# Altium project QCopterMV.PrjPCB
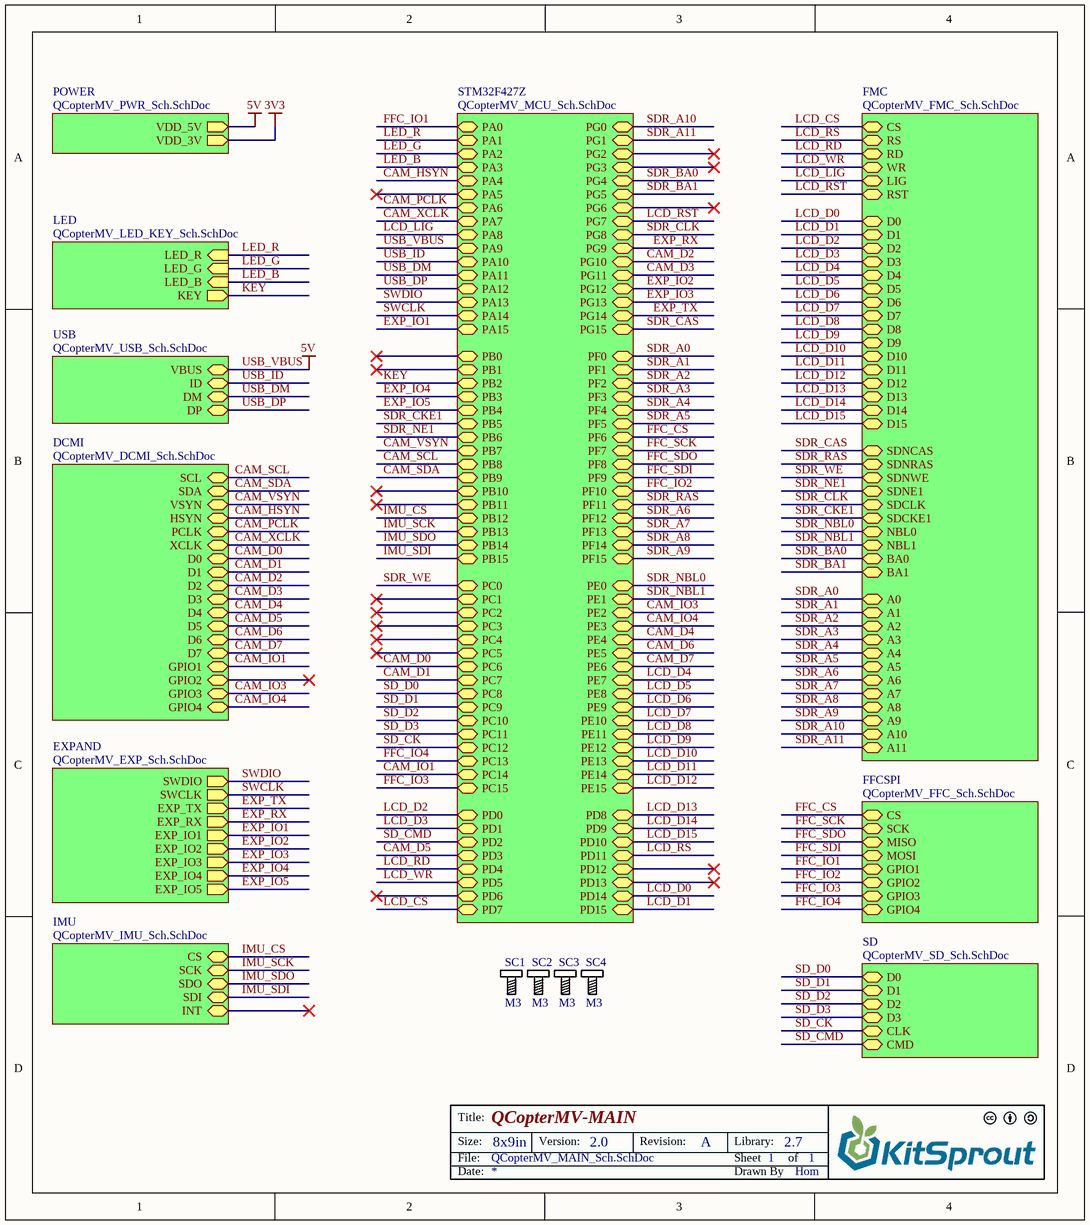
[diagram p0: QCopterMV_MAIN_Sch.SchDoc]
11 sheets, 67 parts. Net scope: hierarchical (ports join the sheet entries above them; power ports are global).
Board file: QCopterMV__Pcb.PcbDoc
Sheets:
  QCopterMV_MAIN_Sch.SchDoc
    STM32F427Z = QCopterMV_MCU_Sch.SchDoc
    FMC = QCopterMV_FMC_Sch.SchDoc
    POWER = QCopterMV_PWR_Sch.SchDoc
    LED = QCopterMV_LED_KEY_Sch.SchDoc
    FFCSPI = QCopterMV_FFC_Sch.SchDoc
    SD = QCopterMV_SD_Sch.SchDoc
    DCMI = QCopterMV_DCMI_Sch.SchDoc
    EXPAND = QCopterMV_EXP_Sch.SchDoc
    USB = QCopterMV_USB_Sch.SchDoc
    IMU = QCopterMV_IMU_Sch.SchDoc

## Sheet QCopterMV_MAIN_Sch.SchDoc: QCopterMV-MAIN
size 203 x 228 mm; Author: Hom; CompanyName: KitSprout; DrawnBy: Hom; Engineer: Hom; Organization: KitSprout; Revision: A; SheetNumber: 1; SheetTotal: 1; License: CC BY-SA 4.0; Version: 2.0; LibVersion: 2.7; PageSetup: Record=PageOptions|CenterHorizontal=True|CenterVertical=True|PrintScale=1.00|XCorrection=1.00|YCorrection=1.00|PrintKind=0|BorderSize=5000000|LeftOffset=0|BottomOffset=0|Orientation=2|PaperLength=1000|PaperWidth=1000|Scale=100|PaperSource=7|PrintQuality=-4|MediaType=1|DitherType=10|PaperKind=A4|PrintScaleMode=0

### Parts
SC1  M3  [SCRREW_M3]
SC2  M3  [SCRREW_M3]
SC3  M3  [SCRREW_M3]
SC4  M3  [SCRREW_M3]

### Sub-sheets
DCMI = QCopterMV_DCMI_Sch.SchDoc: SCL, SDA, VSYN, HSYN, PCLK, XCLK, D0, D1, D2, D3, D4, D5, D6, D7, GPIO1, GPIO2, GPIO3, GPIO4
EXPAND = QCopterMV_EXP_Sch.SchDoc: SWDIO (out), SWCLK (out), EXP_TX (out), EXP_RX (out), EXP_IO1 (out), EXP_IO2 (out), EXP_IO3 (out), EXP_IO4 (out), EXP_IO5 (out)
FFCSPI = QCopterMV_FFC_Sch.SchDoc: MISO, CS, MOSI, SCK, GPIO1, GPIO2, GPIO3, GPIO4
FMC = QCopterMV_FMC_Sch.SchDoc: D0, D1, D2, D3, D4, D5, D6, D7, D8, D9, D10, D11, D12, D13, D14, D15, RD, WR, CS, RS, LIG, RST, NBL0, NBL1, BA1, BA0, SDNRAS, SDNCAS, SDNWE, SDNE1, SDCLK, SDCKE1, A0, A1, A2, A3, A4, A5, A6, A7, A8, A9, A10, A11
IMU = QCopterMV_IMU_Sch.SchDoc: SDO, SCK, SDI, CS, INT
LED = QCopterMV_LED_KEY_Sch.SchDoc: LED_R (in), LED_G (in), LED_B (in), KEY (out)
POWER = QCopterMV_PWR_Sch.SchDoc: VDD_3V (out), VDD_5V (out)
SD = QCopterMV_SD_Sch.SchDoc: D0, CMD, D1, D2, D3, CLK
STM32F427Z = QCopterMV_MCU_Sch.SchDoc: PA0, PA1, PA2, PA3, PA4, PA5, PA6, PA7, PA8, PA9, PA10, PA11, PA12, PA13, PA14, PA15, PB0, PB1, PB2, PB3, PB4, PB5, PB6, PB7, PB8, PB9, PB10, PB12, PB13, PB14, PB15, PC0, PC1, PC2, PC3, PC5, PC6, PC7, PC8, PC9, PC10, PC11, PC12, PC13, PC14, PB11, PD0, PC4, PC15, PD1, PD2, PD3, PD4, PD5, PD6, PD7, PD8, PD9, PD10, PD11, PD12, PD13, PD14, PD15, PE0, PF0, PG0, PG1, PG2, PG3, PG4, PG5, PG6, PG7, PG8, PG9, PG10, PG11, PG12, PG13, PG14, PG15, PF1, PF2, PF3, PF4, PF5, PF6, PF7, PF8, PF9, PF10, PF11, PF12, PF13, PF14, PF15, PE1, PE2, PE3, PE4, PE5, PE6, PE7, PE8, PE9, PE10, PE11, PE12, PE13, PE14, PE15
USB = QCopterMV_USB_Sch.SchDoc: VBUS, ID, DM, DP

### Nets
USB_VBUS: sheet STM32F427Z/PA9, sheet POWER/VDD_5V, sheet USB/VBUS  [also labelled 5V]
CAM_D0: sheet STM32F427Z/PC6, sheet DCMI/D0
CAM_D1: sheet STM32F427Z/PC7, sheet DCMI/D1
CAM_D2: sheet STM32F427Z/PG10, sheet DCMI/D2
CAM_D3: sheet STM32F427Z/PG11, sheet DCMI/D3
CAM_D4: sheet STM32F427Z/PE4, sheet DCMI/D4
CAM_D5: sheet STM32F427Z/PD3, sheet DCMI/D5
CAM_D6: sheet STM32F427Z/PE5, sheet DCMI/D6
CAM_D7: sheet STM32F427Z/PE6, sheet DCMI/D7
CAM_HSYN: sheet STM32F427Z/PA4, sheet DCMI/HSYN
CAM_IO1: sheet STM32F427Z/PC14, sheet DCMI/GPIO1
CAM_IO3: sheet STM32F427Z/PE2, sheet DCMI/GPIO3
CAM_IO4: sheet STM32F427Z/PE3, sheet DCMI/GPIO4
CAM_PCLK: sheet STM32F427Z/PA6, sheet DCMI/PCLK
CAM_SCL: sheet STM32F427Z/PB8, sheet DCMI/SCL
CAM_SDA: sheet STM32F427Z/PB9, sheet DCMI/SDA
CAM_VSYN: sheet STM32F427Z/PB7, sheet DCMI/VSYN
CAM_XCLK: sheet STM32F427Z/PA7, sheet DCMI/XCLK
EXP_IO1: sheet STM32F427Z/PA15, sheet EXPAND/EXP_IO1
EXP_IO2: sheet STM32F427Z/PG12, sheet EXPAND/EXP_IO2
EXP_IO3: sheet STM32F427Z/PG13, sheet EXPAND/EXP_IO3
EXP_IO4: sheet STM32F427Z/PB3, sheet EXPAND/EXP_IO4
EXP_IO5: sheet STM32F427Z/PB4, sheet EXPAND/EXP_IO5
EXP_RX: sheet STM32F427Z/PG9, sheet EXPAND/EXP_RX
EXP_TX: sheet STM32F427Z/PG14, sheet EXPAND/EXP_TX
FFC_CS: sheet STM32F427Z/PF6, sheet FFCSPI/CS
FFC_IO1: sheet STM32F427Z/PA0, sheet FFCSPI/GPIO1
FFC_IO2: sheet STM32F427Z/PF10, sheet FFCSPI/GPIO2
FFC_IO3: sheet STM32F427Z/PC15, sheet FFCSPI/GPIO3
FFC_IO4: sheet STM32F427Z/PC13, sheet FFCSPI/GPIO4
FFC_SCK: sheet STM32F427Z/PF7, sheet FFCSPI/SCK
FFC_SDI: sheet STM32F427Z/PF9, sheet FFCSPI/MOSI
FFC_SDO: sheet STM32F427Z/PF8, sheet FFCSPI/MISO
IMU_CS: sheet STM32F427Z/PB12, sheet IMU/CS
IMU_SCK: sheet STM32F427Z/PB13, sheet IMU/SCK
IMU_SDI: sheet STM32F427Z/PB15, sheet IMU/SDI
IMU_SDO: sheet STM32F427Z/PB14, sheet IMU/SDO
KEY: sheet STM32F427Z/PB2, sheet LED/KEY
LCD_CS: sheet STM32F427Z/PD7, sheet FMC/CS
LCD_D0: sheet STM32F427Z/PD14, sheet FMC/D0
LCD_D1: sheet STM32F427Z/PD15, sheet FMC/D1
LCD_D2: sheet STM32F427Z/PD0, sheet FMC/D2
LCD_D3: sheet STM32F427Z/PD1, sheet FMC/D3
LCD_D4: sheet STM32F427Z/PE7, sheet FMC/D4
LCD_D5: sheet STM32F427Z/PE8, sheet FMC/D5
LCD_D6: sheet STM32F427Z/PE9, sheet FMC/D6
LCD_D7: sheet STM32F427Z/PE10, sheet FMC/D7
LCD_D8: sheet STM32F427Z/PE11, sheet FMC/D8
LCD_D9: sheet STM32F427Z/PE12, sheet FMC/D9
LCD_D10: sheet STM32F427Z/PE13, sheet FMC/D10
LCD_D11: sheet STM32F427Z/PE14, sheet FMC/D11
LCD_D12: sheet STM32F427Z/PE15, sheet FMC/D12
LCD_D13: sheet STM32F427Z/PD8, sheet FMC/D13
LCD_D14: sheet STM32F427Z/PD9, sheet FMC/D14
LCD_D15: sheet STM32F427Z/PD10, sheet FMC/D15
LCD_LIG: sheet STM32F427Z/PA8, sheet FMC/LIG
LCD_RD: sheet STM32F427Z/PD4, sheet FMC/RD
LCD_RS: sheet STM32F427Z/PD11, sheet FMC/RS
LCD_RST: sheet STM32F427Z/PG7, sheet FMC/RST
LCD_WR: sheet STM32F427Z/PD5, sheet FMC/WR
LED_B: sheet STM32F427Z/PA3, sheet LED/LED_B
LED_G: sheet STM32F427Z/PA2, sheet LED/LED_G
LED_R: sheet STM32F427Z/PA1, sheet LED/LED_R
SD_CK: sheet STM32F427Z/PC12, sheet SD/CLK
SD_CMD: sheet STM32F427Z/PD2, sheet SD/CMD
SD_D0: sheet STM32F427Z/PC8, sheet SD/D0
SD_D1: sheet STM32F427Z/PC9, sheet SD/D1
SD_D2: sheet STM32F427Z/PC10, sheet SD/D2
SD_D3: sheet STM32F427Z/PC11, sheet SD/D3
SDR_A0: sheet STM32F427Z/PF0, sheet FMC/A0
SDR_A1: sheet STM32F427Z/PF1, sheet FMC/A1
SDR_A2: sheet STM32F427Z/PF2, sheet FMC/A2
SDR_A3: sheet STM32F427Z/PF3, sheet FMC/A3
SDR_A4: sheet STM32F427Z/PF4, sheet FMC/A4
SDR_A5: sheet STM32F427Z/PF5, sheet FMC/A5
SDR_A6: sheet STM32F427Z/PF12, sheet FMC/A6
SDR_A7: sheet STM32F427Z/PF13, sheet FMC/A7
SDR_A8: sheet STM32F427Z/PF14, sheet FMC/A8
SDR_A9: sheet STM32F427Z/PF15, sheet FMC/A9
SDR_A10: sheet STM32F427Z/PG0, sheet FMC/A10
SDR_A11: sheet STM32F427Z/PG1, sheet FMC/A11
SDR_BA0: sheet STM32F427Z/PG4, sheet FMC/BA0
SDR_BA1: sheet STM32F427Z/PG5, sheet FMC/BA1
SDR_CAS: sheet STM32F427Z/PG15, sheet FMC/SDNCAS
SDR_CKE1: sheet STM32F427Z/PB5, sheet FMC/SDCKE1
SDR_CLK: sheet STM32F427Z/PG8, sheet FMC/SDCLK
SDR_NBL0: sheet STM32F427Z/PE0, sheet FMC/NBL0
SDR_NBL1: sheet STM32F427Z/PE1, sheet FMC/NBL1
SDR_NE1: sheet STM32F427Z/PB6, sheet FMC/SDNE1
SDR_RAS: sheet STM32F427Z/PF11, sheet FMC/SDNRAS
SDR_WE: sheet STM32F427Z/PC0, sheet FMC/SDNWE
SWCLK: sheet STM32F427Z/PA14, sheet EXPAND/SWCLK
SWDIO: sheet STM32F427Z/PA13, sheet EXPAND/SWDIO
USB_DM: sheet STM32F427Z/PA11, sheet USB/DM
USB_DP: sheet STM32F427Z/PA12, sheet USB/DP
USB_ID: sheet STM32F427Z/PA10, sheet USB/ID

### Notes on the sheet
- Title:
- Size:
- Date:
- File:
- 8x9in
- Version:
- Revision:
- Sheet
- Drawn By
- Library:
- of

### Library data of the parts
SC1-SC4 = Screw_M3: Screw

## Sheet QCopterMV_MCU_Sch.SchDoc: QCopterMV-MCU
size 177 x 203 mm; Author: Hom; CompanyName: KitSprout; DrawnBy: Hom; Engineer: Hom; Organization: KitSprout; Revision: A; SheetNumber: 1; SheetTotal: 1; License: CC BY-SA 4.0; Version: 2.0; LibVersion: 2.7; PageSetup: Record=PageOptions|CenterHorizontal=True|CenterVertical=True|PrintScale=1.00|XCorrection=1.00|YCorrection=1.00|PrintKind=0|BorderSize=5000000|LeftOffset=0|BottomOffset=0|Orientation=2|PaperLength=1000|PaperWidth=1000|Scale=100|PaperSource=7|PrintQuality=-4|MediaType=1|DitherType=10|PaperKind=A4|PrintScaleMode=0
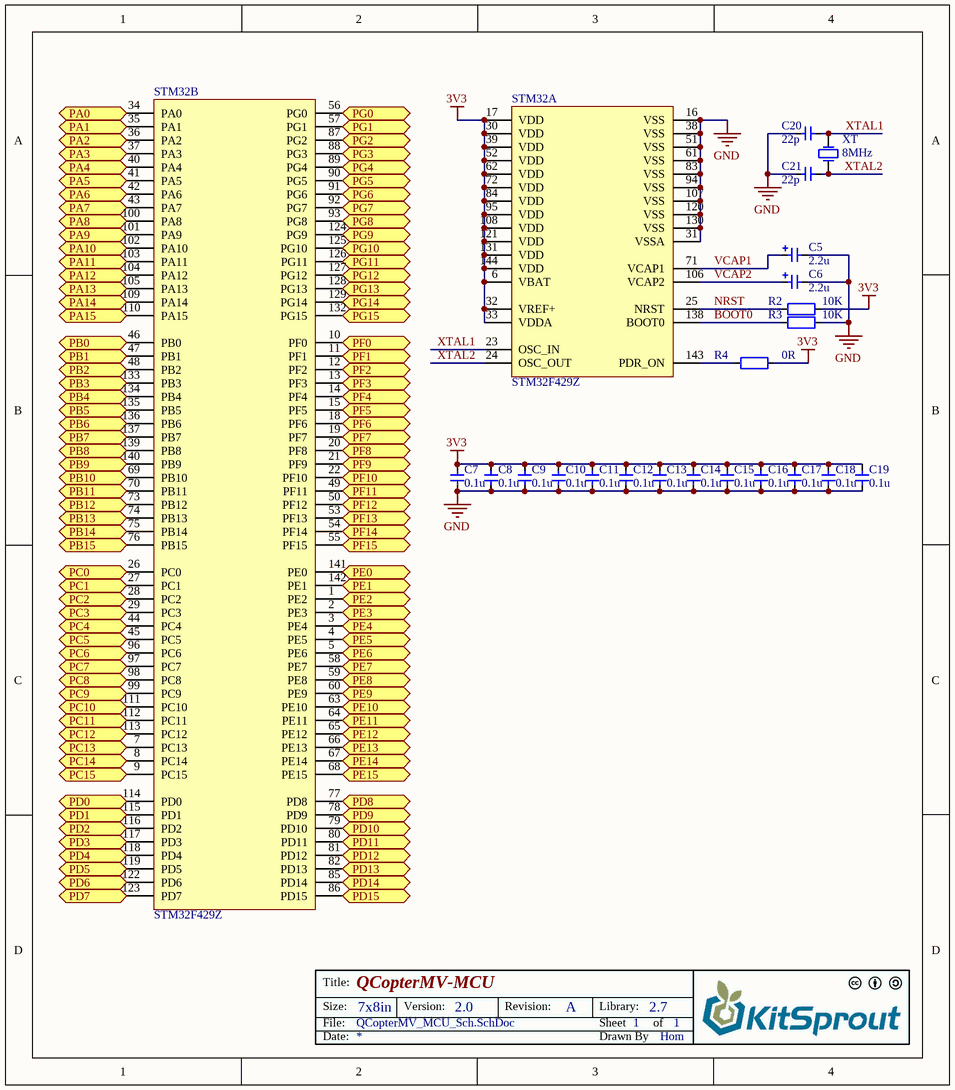
[diagram p1: QCopterMV_MCU_Sch.SchDoc]

### Parts
C5  value 2.2u  [CAP_TAN_P0805]  (hidden comment: Cap_Tan_0805)
C6  value 2.2u  [CAP_TAN_P0805]  (hidden comment: Cap_Tan_0805)
C7  value 0.1u  [CAP_0402]  (hidden comment: Cap_0402)
C8  value 0.1u  [CAP_0402]  (hidden comment: Cap_0402)
C9  value 0.1u  [CAP_0402]  (hidden comment: Cap_0402)
C10  value 0.1u  [CAP_0402]  (hidden comment: Cap_0402)
C11  value 0.1u  [CAP_0402]  (hidden comment: Cap_0402)
C12  value 0.1u  [CAP_0402]  (hidden comment: Cap_0402)
C13  value 0.1u  [CAP_0402]  (hidden comment: Cap_0402)
C14  value 0.1u  [CAP_0402]  (hidden comment: Cap_0402)
C15  value 0.1u  [CAP_0402]  (hidden comment: Cap_0402)
C16  value 0.1u  [CAP_0402]  (hidden comment: Cap_0402)
C17  value 0.1u  [CAP_0402]  (hidden comment: Cap_0402)
C18  value 0.1u  [CAP_0402]  (hidden comment: Cap_0402)
C19  value 0.1u  [CAP_0402]  (hidden comment: Cap_0402)
C20  value 22p  [CAP_0402]  (hidden comment: Cap_0402)
C21  value 22p  [CAP_0402]  (hidden comment: Cap_0402)
R2  value 10K  [RES_0402]  (hidden comment: Res_0402)
R3  value 10K  [RES_0402]  (hidden comment: Res_0402)
R4  value 0R  [RES_0402]  (hidden comment: Res_0402)
STM32  STM32F429Z  [LQFP_P0.5_144]  (parts A,B of 2)
XT  value 8MHz  [XT_3225_2]  (hidden comment: XTAL_3225_2P)

### Ports
PA0, PA1, PA2, PA3, PA4, PA5, PA6, PA7, PA8, PA9, PA10, PA11, PA12, PA13, PA14, PA15, PB0, PB1, PB2, PB3, PB4, PB5, PB6, PB7, PB8, PB9, PB10, PB11, PB12, PB13, PB14, PB15, PC0, PC1, PC2, PC3, PC4, PC5, PC6, PC7, PC8, PC9, PC10, PC11, PC12, PC13, PC14, PC15, PD0, PD1, PD2, PD3, PD4, PD5, PD6, PD7, PD8, PD9, PD10, PD11, PD12, PD13, PD14, PD15, PE0, PE1, PE2, PE3, PE4, PE5, PE6, PE7, PE8, PE9, PE10, PE11, PE12, PE13, PE14, PE15, PF0, PF1, PF2, PF3, PF4, PF5, PF6, PF7, PF8, PF9, PF10, PF11, PF12, PF13, PF14, PF15, PG0, PG1, PG2, PG3, PG4, PG5, PG6, PG7, PG8, PG9, PG10, PG11, PG12, PG13, PG14, PG15

### Nets
3V3: C7.2 C8.2 C9.2 C10.2 C11.2 C12.2 C13.2 C14.2 C15.2 C16.2 C17.2 C18.2 C19.2 R2.1 R4.1 STM32.6(VBAT) STM32.17(VDD) STM32.30(VDD) STM32.32(VREF+) STM32.33(VDDA) STM32.39(VDD) STM32.52(VDD) STM32.62(VDD) STM32.72(VDD) STM32.84(VDD) STM32.95(VDD) STM32.108(VDD) STM32.121(VDD) STM32.131(VDD) STM32.144(VDD)
GND: C5.2 C6.2 C7.1 C8.1 C9.1 C10.1 C11.1 C12.1 C13.1 C14.1 C15.1 C16.1 C17.1 C18.1 C19.1 C20.1 C21.1 R3.1 STM32.16(VSS) STM32.31(VSSA) STM32.38(VSS) STM32.51(VSS) STM32.61(VSS) STM32.83(VSS) STM32.94(VSS) STM32.107(VSS) STM32.120(VSS) STM32.130(VSS)
USB_VBUS: STM32.101(PA9) ; port PA9
BOOT0: R3.2 STM32.138(BOOT0)
CAM_D0: STM32.96(PC6) ; port PC6
CAM_D1: STM32.97(PC7) ; port PC7
CAM_D2: STM32.125(PG10) ; port PG10
CAM_D3: STM32.126(PG11) ; port PG11
CAM_D4: STM32.3(PE4) ; port PE4
CAM_D5: STM32.117(PD3) ; port PD3
CAM_D6: STM32.4(PE5) ; port PE5
CAM_D7: STM32.5(PE6) ; port PE6
CAM_HSYN: STM32.40(PA4) ; port PA4
CAM_IO1: STM32.8(PC14) ; port PC14
CAM_IO3: STM32.1(PE2) ; port PE2
CAM_IO4: STM32.2(PE3) ; port PE3
CAM_PCLK: STM32.42(PA6) ; port PA6
CAM_SCL: STM32.139(PB8) ; port PB8
CAM_SDA: STM32.140(PB9) ; port PB9
CAM_VSYN: STM32.137(PB7) ; port PB7
CAM_XCLK: STM32.43(PA7) ; port PA7
EXP_IO1: STM32.110(PA15) ; port PA15
EXP_IO2: STM32.127(PG12) ; port PG12
EXP_IO3: STM32.128(PG13) ; port PG13
EXP_IO4: STM32.133(PB3) ; port PB3
EXP_IO5: STM32.134(PB4) ; port PB4
EXP_RX: STM32.124(PG9) ; port PG9
EXP_TX: STM32.129(PG14) ; port PG14
FFC_CS: STM32.18(PF6) ; port PF6
FFC_IO1: STM32.34(PA0) ; port PA0
FFC_IO2: STM32.22(PF10) ; port PF10
FFC_IO3: STM32.9(PC15) ; port PC15
FFC_IO4: STM32.7(PC13) ; port PC13
FFC_SCK: STM32.19(PF7) ; port PF7
FFC_SDI: STM32.21(PF9) ; port PF9
FFC_SDO: STM32.20(PF8) ; port PF8
IMU_CS: STM32.73(PB12) ; port PB12
IMU_SCK: STM32.74(PB13) ; port PB13
IMU_SDI: STM32.76(PB15) ; port PB15
IMU_SDO: STM32.75(PB14) ; port PB14
KEY: STM32.48(PB2) ; port PB2
LCD_CS: STM32.123(PD7) ; port PD7
LCD_D0: STM32.85(PD14) ; port PD14
LCD_D1: STM32.86(PD15) ; port PD15
LCD_D2: STM32.114(PD0) ; port PD0
LCD_D3: STM32.115(PD1) ; port PD1
LCD_D4: STM32.58(PE7) ; port PE7
LCD_D5: STM32.59(PE8) ; port PE8
LCD_D6: STM32.60(PE9) ; port PE9
LCD_D7: STM32.63(PE10) ; port PE10
LCD_D8: STM32.64(PE11) ; port PE11
LCD_D9: STM32.65(PE12) ; port PE12
LCD_D10: STM32.66(PE13) ; port PE13
LCD_D11: STM32.67(PE14) ; port PE14
LCD_D12: STM32.68(PE15) ; port PE15
LCD_D13: STM32.77(PD8) ; port PD8
LCD_D14: STM32.78(PD9) ; port PD9
LCD_D15: STM32.79(PD10) ; port PD10
LCD_LIG: STM32.100(PA8) ; port PA8
LCD_RD: STM32.118(PD4) ; port PD4
LCD_RS: STM32.80(PD11) ; port PD11
LCD_RST: STM32.92(PG7) ; port PG7
LCD_WR: STM32.119(PD5) ; port PD5
LED_B: STM32.37(PA3) ; port PA3
LED_G: STM32.36(PA2) ; port PA2
LED_R: STM32.35(PA1) ; port PA1
NRST: R2.2 STM32.25(NRST)
SD_CK: STM32.113(PC12) ; port PC12
SD_CMD: STM32.116(PD2) ; port PD2
SD_D0: STM32.98(PC8) ; port PC8
SD_D1: STM32.99(PC9) ; port PC9
SD_D2: STM32.111(PC10) ; port PC10
SD_D3: STM32.112(PC11) ; port PC11
SDR_A0: STM32.10(PF0) ; port PF0
SDR_A1: STM32.11(PF1) ; port PF1
SDR_A2: STM32.12(PF2) ; port PF2
SDR_A3: STM32.13(PF3) ; port PF3
SDR_A4: STM32.14(PF4) ; port PF4
SDR_A5: STM32.15(PF5) ; port PF5
SDR_A6: STM32.50(PF12) ; port PF12
SDR_A7: STM32.53(PF13) ; port PF13
SDR_A8: STM32.54(PF14) ; port PF14
SDR_A9: STM32.55(PF15) ; port PF15
SDR_A10: STM32.56(PG0) ; port PG0
SDR_A11: STM32.57(PG1) ; port PG1
SDR_BA0: STM32.89(PG4) ; port PG4
SDR_BA1: STM32.90(PG5) ; port PG5
SDR_CAS: STM32.132(PG15) ; port PG15
SDR_CKE1: STM32.135(PB5) ; port PB5
SDR_CLK: STM32.93(PG8) ; port PG8
SDR_NBL0: STM32.141(PE0) ; port PE0
SDR_NBL1: STM32.142(PE1) ; port PE1
SDR_NE1: STM32.136(PB6) ; port PB6
SDR_RAS: STM32.49(PF11) ; port PF11
SDR_WE: STM32.26(PC0) ; port PC0
SWCLK: STM32.109(PA14) ; port PA14
SWDIO: STM32.105(PA13) ; port PA13
USB_DM: STM32.103(PA11) ; port PA11
USB_DP: STM32.104(PA12) ; port PA12
USB_ID: STM32.102(PA10) ; port PA10
VCAP1: C5.1 STM32.71(VCAP1)
VCAP2: C6.1 STM32.106(VCAP2)
XTAL1: C20.2 STM32.23(OSC_IN) XT.2(OSC2)
XTAL2: C21.2 STM32.24(OSC_OUT) XT.1(OSC1)
NetR4_2: R4.2 STM32.143(PDR_ON)
NetSTM32_27: STM32.27(PC1) ; port PC1
NetSTM32_28: STM32.28(PC2) ; port PC2
NetSTM32_29: STM32.29(PC3) ; port PC3
NetSTM32_41: STM32.41(PA5) ; port PA5
NetSTM32_44: STM32.44(PC4) ; port PC4
NetSTM32_45: STM32.45(PC5) ; port PC5
NetSTM32_46: STM32.46(PB0) ; port PB0
NetSTM32_47: STM32.47(PB1) ; port PB1
NetSTM32_69: STM32.69(PB10) ; port PB10
NetSTM32_70: STM32.70(PB11) ; port PB11
NetSTM32_81: STM32.81(PD12) ; port PD12
NetSTM32_82: STM32.82(PD13) ; port PD13
NetSTM32_87: STM32.87(PG2) ; port PG2
NetSTM32_88: STM32.88(PG3) ; port PG3
NetSTM32_91: STM32.91(PG6) ; port PG6
NetSTM32_122: STM32.122(PD6) ; port PD6

### Notes on the sheet
- Title:
- Size:
- Date:
- File:
- 7x8in
- Version:
- Revision:
- Sheet
- Drawn By
- Library:
- of

### Library data of the parts
C5 C6 = Cap_Tan_0805: Capacitor
C7-C21 = Cap_0402: Capacitor
R2-R4 = Res_0402: Resistor
STM32 = STM32F439Z: MCU
XT = XTAL_3225_2P: Crystal Oscillator

## Sheet QCopterMV_FMC_Sch.SchDoc: QCopterMV-FMC
size 152 x 127 mm; Author: Hom; CompanyName: KitSprout; DrawnBy: Hom; Engineer: Hom; Organization: KitSprout; Revision: A; SheetNumber: 1; SheetTotal: 1; License: CC BY-SA 4.0; Version: 2.0; LibVersion: 2.7; PageSetup: Record=PageOptions|CenterHorizontal=True|CenterVertical=True|PrintScale=1.00|XCorrection=1.00|YCorrection=1.00|PrintKind=0|BorderSize=5000000|LeftOffset=0|BottomOffset=0|Orientation=2|PaperLength=1000|PaperWidth=1000|Scale=100|PaperSource=7|PrintQuality=-4|MediaType=1|DitherType=10|PaperKind=A4|PrintScaleMode=0
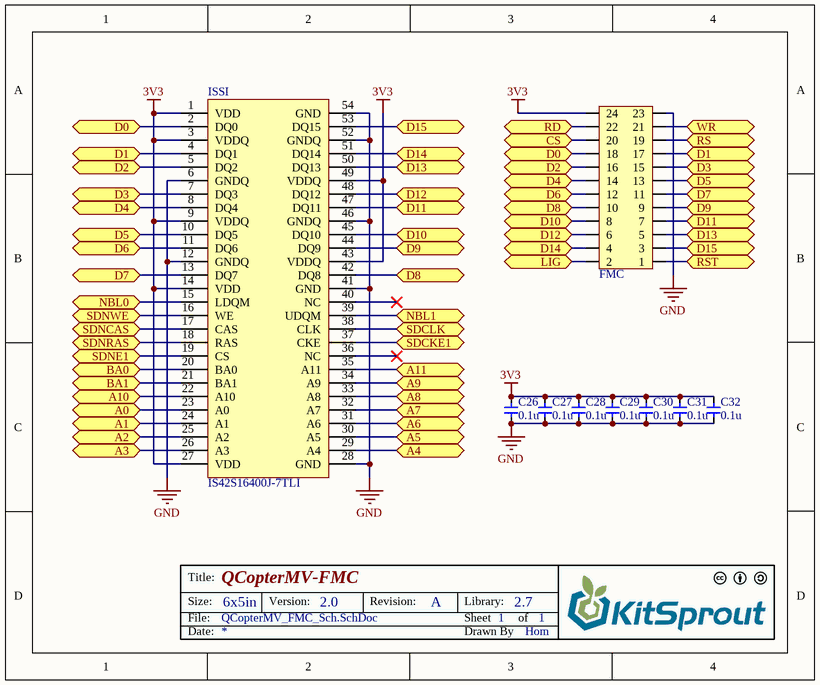
[diagram p2: QCopterMV_FMC_Sch.SchDoc]

### Parts
C26  value 0.1u  [CAP_0402]  (hidden comment: Cap_0402)
C27  value 0.1u  [CAP_0402]  (hidden comment: Cap_0402)
C28  value 0.1u  [CAP_0402]  (hidden comment: Cap_0402)
C29  value 0.1u  [CAP_0402]  (hidden comment: Cap_0402)
C30  value 0.1u  [CAP_0402]  (hidden comment: Cap_0402)
C31  value 0.1u  [CAP_0402]  (hidden comment: Cap_0402)
C32  value 0.1u  [CAP_0402]  (hidden comment: Cap_0402)
FMC  HDR2x12_1.27  [HDR2X12_1.27_180HF]  (value not drawn)
ISSI  IS42S16400J-7TLI  [TSOP_E400_P0.8_54]

### Ports
A0, A1, A2, A3, A4, A5, A6, A7, A8, A9, A10, A11, BA0, BA1, CS, D0, D1, D2, D3, D4, D5, D6, D7, D8, D9, D10, D11, D12, D13, D14, D15, LIG, NBL0, NBL1, RD, RS, RST, SDCKE1, SDCLK, SDNCAS, SDNE1, SDNRAS, SDNWE, WR

### Nets
3V3: C26.2 C27.2 C28.2 C29.2 C30.2 C31.2 C32.2 FMC.24 ISSI.1(VDD) ISSI.3(VDDQ) ISSI.9(VDDQ) ISSI.14(VDD) ISSI.27(VDD) ISSI.43(VDDQ) ISSI.49(VDDQ)
GND: C26.1 C27.1 C28.1 C29.1 C30.1 C31.1 C32.1 FMC.23 ISSI.6(GNDQ) ISSI.12(GNDQ) ISSI.28(GND) ISSI.41(GND) ISSI.46(GNDQ) ISSI.52(GNDQ) ISSI.54(GND)
LCD_CS: FMC.20 ; port CS
LCD_D0: FMC.18 ISSI.2(DQ0) ; port D0
LCD_D1: FMC.17 ISSI.4(DQ1) ; port D1
LCD_D2: FMC.16 ISSI.5(DQ2) ; port D2
LCD_D3: FMC.15 ISSI.7(DQ3) ; port D3
LCD_D4: FMC.14 ISSI.8(DQ4) ; port D4
LCD_D5: FMC.13 ISSI.10(DQ5) ; port D5
LCD_D6: FMC.12 ISSI.11(DQ6) ; port D6
LCD_D7: FMC.11 ISSI.13(DQ7) ; port D7
LCD_D8: FMC.10 ISSI.42(DQ8) ; port D8
LCD_D9: FMC.9 ISSI.44(DQ9) ; port D9
LCD_D10: FMC.8 ISSI.45(DQ10) ; port D10
LCD_D11: FMC.7 ISSI.47(DQ11) ; port D11
LCD_D12: FMC.6 ISSI.48(DQ12) ; port D12
LCD_D13: FMC.5 ISSI.50(DQ13) ; port D13
LCD_D14: FMC.4 ISSI.51(DQ14) ; port D14
LCD_D15: FMC.3 ISSI.53(DQ15) ; port D15
LCD_LIG: FMC.2 ; port LIG
LCD_RD: FMC.22 ; port RD
LCD_RS: FMC.19 ; port RS
LCD_RST: FMC.1 ; port RST
LCD_WR: FMC.21 ; port WR
SDR_A0: ISSI.23(A0) ; port A0
SDR_A1: ISSI.24(A1) ; port A1
SDR_A2: ISSI.25(A2) ; port A2
SDR_A3: ISSI.26(A3) ; port A3
SDR_A4: ISSI.29(A4) ; port A4
SDR_A5: ISSI.30(A5) ; port A5
SDR_A6: ISSI.31(A6) ; port A6
SDR_A7: ISSI.32(A7) ; port A7
SDR_A8: ISSI.33(A8) ; port A8
SDR_A9: ISSI.34(A9) ; port A9
SDR_A10: ISSI.22(A10) ; port A10
SDR_A11: ISSI.35(A11) ; port A11
SDR_BA0: ISSI.20(BA0) ; port BA0
SDR_BA1: ISSI.21(BA1) ; port BA1
SDR_CAS: ISSI.17(CAS) ; port SDNCAS
SDR_CKE1: ISSI.37(CKE) ; port SDCKE1
SDR_CLK: ISSI.38(CLK) ; port SDCLK
SDR_NBL0: ISSI.15(LDQM) ; port NBL0
SDR_NBL1: ISSI.39(UDQM) ; port NBL1
SDR_NE1: ISSI.19(CS) ; port SDNE1
SDR_RAS: ISSI.18(RAS) ; port SDNRAS
SDR_WE: ISSI.16(WE) ; port SDNWE

Not connected (* = marked no-connect by the designer): ISSI 36(NC)* 40(NC)*

### Notes on the sheet
- Title:
- Size:
- Date:
- File:
- 6x5in
- Version:
- Revision:
- Sheet
- Drawn By
- Library:
- of

### Library data of the parts
C26-C32 = Cap_0402: Capacitor
FMC = HDR2x12_1.27: Header
ISSI = IS42S16400: SDRAM

## Sheet QCopterMV_PWR_Sch.SchDoc: QCopterMV-PWR
size 127 x 101 mm; Author: Hom; CompanyName: KitSprout; DrawnBy: Hom; Engineer: Hom; Organization: KitSprout; Revision: A; SheetNumber: 1; SheetTotal: 1; License: CC BY-SA 4.0; Version: 2.0; LibVersion: 2.7; PageSetup: Record=PageOptions|CenterHorizontal=True|CenterVertical=True|PrintScale=1.00|XCorrection=1.00|YCorrection=1.00|PrintKind=0|BorderSize=5000000|LeftOffset=0|BottomOffset=0|Orientation=2|PaperLength=1000|PaperWidth=1000|Scale=100|PaperSource=7|PrintQuality=-4|MediaType=1|DitherType=10|PaperKind=A4|PrintScaleMode=0
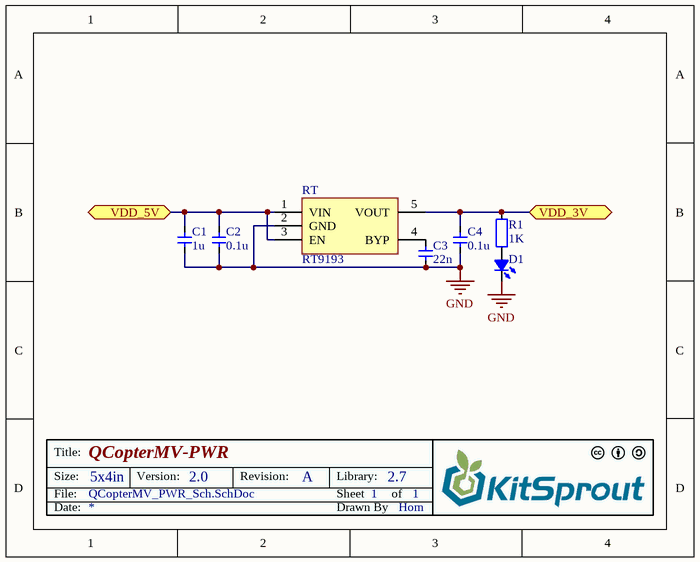
[diagram p3: QCopterMV_PWR_Sch.SchDoc]

### Parts
C1  value 1u  [CAP_0603]  (hidden comment: Cap_0603)
C2  value 0.1u  [CAP_0603]  (hidden comment: Cap_0603)
C3  value 22n  [CAP_0603]  (hidden comment: Cap_0603)
C4  value 0.1u  [CAP_0603]  (hidden comment: Cap_0603)
D1  LED_0805  [LED_0805_ORANGE]  (value not drawn)
R1  value 1K  [RES_0603]  (hidden comment: Res_0603)
RT  RT9193  [SOT23-5]

### Ports
VDD_3V, VDD_5V

### Nets
3V3: C4.2 R1.2 RT.5(VOUT) ; port VDD_3V
GND: C1.1 C2.1 C3.2 C4.1 D1.2(K) RT.2(GND)
USB_VBUS: C1.2 C2.2 RT.1(VIN) RT.3(EN) ; port VDD_5V
NetC3_1: C3.1 RT.4(BYP)
NetD1_1: D1.1(A) R1.1

### Notes on the sheet
- Title:
- Size:
- Date:
- File:
- 5x4in
- Version:
- Revision:
- Sheet
- Drawn By
- Library:
- of

### Library data of the parts
C1-C4 = Cap_0603: Capacitor
D1 = LED_0805: LED
R1 = Res_0603: Resistor
RT = SP6205: Power

## Sheet QCopterMV_LED_KEY_Sch.SchDoc: QCopterMV-LED
size 127 x 101 mm; Author: Hom; CompanyName: KitSprout; DrawnBy: Hom; Engineer: Hom; Organization: KitSprout; Revision: A; SheetNumber: 1; SheetTotal: 1; Version: 2.0; LibVersion: 2.7
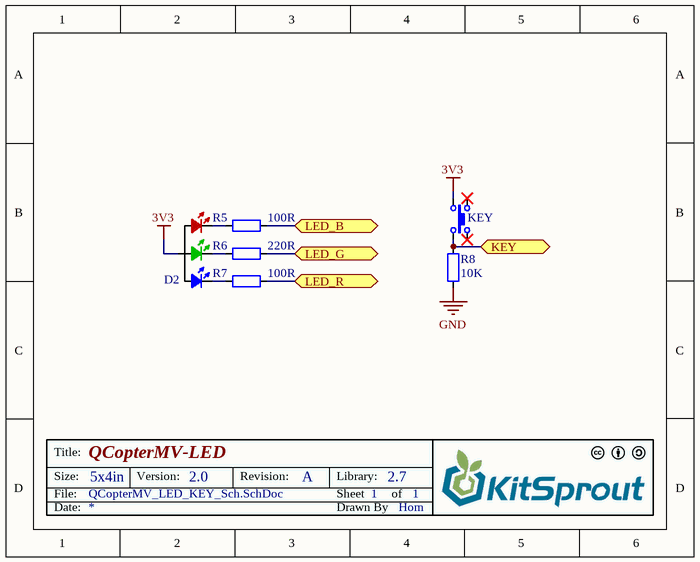
[diagram p4: QCopterMV_LED_KEY_Sch.SchDoc]

### Parts
D2  LED_3528_RGB  [LED_3528_RGB]  (value not drawn)
KEY  ButtonTACT  [ButtonTACT_3.5*3.55_90]  (value not drawn)
R5  value 100R  [RES_0603]  (hidden comment: Res_0603)
R6  value 220R  [RES_0603]  (hidden comment: Res_0603)
R7  value 100R  [RES_0603]  (hidden comment: Res_0603)
R8  value 10K  [RES_0603]  (hidden comment: Res_0603)

### Ports
KEY, LED_B, LED_G, LED_R

### Nets
3V3: D2.2(A) KEY.3
GND: R8.1
KEY: KEY.4 R8.2 ; port KEY
LED_B: R5.2 ; port LED_B
LED_G: R6.2 ; port LED_G
LED_R: R7.2 ; port LED_R
NetD2_1: D2.1(R) R5.1
NetD2_3: D2.3(G) R6.1
NetD2_4: D2.4(B) R7.1

Not connected (* = marked no-connect by the designer): KEY 1* 2*

### Notes on the sheet
- Title:
- Size:
- Date:
- File:
- 5x4in
- Version:
- Revision:
- Sheet
- Drawn By
- Library:
- of

### Library data of the parts
D2 = LED_3528_RGB: LED
KEY = ButtonTACT: Button
R5-R8 = Res_0603: Resistor

## Sheet QCopterMV_FFC_Sch.SchDoc: QCopterMV-FFCSPI
size 127 x 101 mm; Author: Hom; CompanyName: KitSprout; DrawnBy: Hom; Engineer: Hom; Organization: KitSprout; Revision: A; SheetNumber: 1; SheetTotal: 1; License: CC BY-SA 4.0; Version: 2.0; LibVersion: 2.7; PageSetup: Record=PageOptions|CenterHorizontal=True|CenterVertical=True|PrintScale=1.00|XCorrection=1.00|YCorrection=1.00|PrintKind=0|BorderSize=5000000|LeftOffset=0|BottomOffset=0|Orientation=2|PaperLength=1000|PaperWidth=1000|Scale=100|PaperSource=7|PrintQuality=-4|MediaType=1|DitherType=10|PaperKind=A4|PrintScaleMode=0
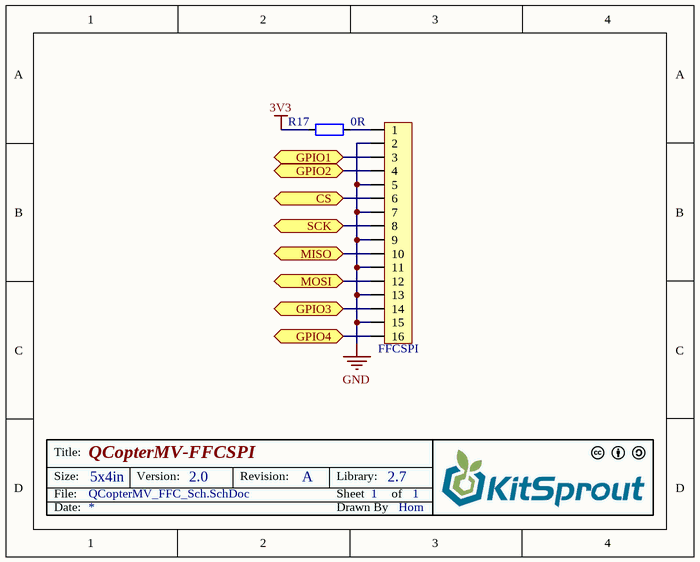
[diagram p5: QCopterMV_FFC_Sch.SchDoc]

### Parts
FFCSPI  FFC_0.5_16  [FFC_0.5_16]  (value not drawn)
R17  value 0R  [RES_0603]  (hidden comment: Res_0603)

### Ports
CS, GPIO1, GPIO2, GPIO3, GPIO4, MISO, MOSI, SCK

### Nets
3V3: R17.1
GND: FFCSPI.2 FFCSPI.5 FFCSPI.7 FFCSPI.9 FFCSPI.11 FFCSPI.13 FFCSPI.15
FFC_CS: FFCSPI.6 ; port CS
FFC_IO1: FFCSPI.3 ; port GPIO1
FFC_IO2: FFCSPI.4 ; port GPIO2
FFC_IO3: FFCSPI.14 ; port GPIO3
FFC_IO4: FFCSPI.16 ; port GPIO4
FFC_SCK: FFCSPI.8 ; port SCK
FFC_SDI: FFCSPI.12 ; port MOSI
FFC_SDO: FFCSPI.10 ; port MISO
NetFFCSPI_1: FFCSPI.1 R17.2

### Notes on the sheet
- Title:
- Size:
- Date:
- File:
- 5x4in
- Version:
- Revision:
- Sheet
- Drawn By
- Library:
- of

### Library data of the parts
FFCSPI = FFC_0.5_16: FFC
R17 = Res_0603: Resistor

## Sheet QCopterMV_SD_Sch.SchDoc: QCopterMV-SD
size 127 x 101 mm; Author: Hom; CompanyName: KitSprout; DrawnBy: Hom; Engineer: Hom; Organization: KitSprout; Revision: A; SheetNumber: 1; SheetTotal: 1; License: CC BY-SA 4.0; Version: 2.0; LibVersion: 2.7; PageSetup: Record=PageOptions|CenterHorizontal=True|CenterVertical=True|PrintScale=1.00|XCorrection=1.00|YCorrection=1.00|PrintKind=0|BorderSize=5000000|LeftOffset=0|BottomOffset=0|Orientation=2|PaperLength=1000|PaperWidth=1000|Scale=100|PaperSource=7|PrintQuality=-4|MediaType=1|DitherType=10|PaperKind=A4|PrintScaleMode=0
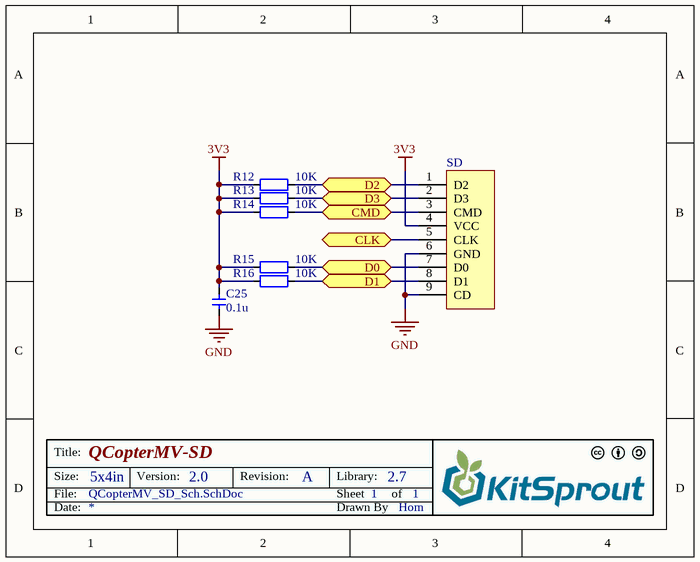
[diagram p6: QCopterMV_SD_Sch.SchDoc]

### Parts
C25  value 0.1u  [CAP_0402]  (hidden comment: Cap_0402)
R12  value 10K  [RES_0402]  (hidden comment: Res_0402)
R13  value 10K  [RES_0402]  (hidden comment: Res_0402)
R14  value 10K  [RES_0402]  (hidden comment: Res_0402)
R15  value 10K  [RES_0402]  (hidden comment: Res_0402)
R16  value 10K  [RES_0402]  (hidden comment: Res_0402)
SD  SD_Card_TF  [SD_Card_TF]  (value not drawn)

### Ports
CLK, CMD, D0, D1, D2, D3

### Nets
3V3: C25.2 R12.1 R13.1 R14.1 R15.1 R16.1 SD.4(VCC)
GND: C25.1 SD.6(GND) SD.9(CD)
SD_CK: SD.5(CLK) ; port CLK
SD_CMD: R14.2 SD.3(CMD) ; port CMD
SD_D0: R15.2 SD.7(D0) ; port D0
SD_D1: R16.2 SD.8(D1) ; port D1
SD_D2: R12.2 SD.1(D2) ; port D2
SD_D3: R13.2 SD.2(D3) ; port D3

### Notes on the sheet
- Title:
- Size:
- Date:
- File:
- 5x4in
- Version:
- Revision:
- Sheet
- Drawn By
- Library:
- of

### Library data of the parts
C25 = Cap_0402: Capacitor
R12-R16 = Res_0402: Resistor
SD = SD_Card_TF: SD

## Sheet QCopterMV_DCMI_Sch.SchDoc: QCopterMV-DCMI
size 127 x 101 mm; Author: Hom; CompanyName: KitSprout; DrawnBy: Hom; Engineer: Hom; Organization: KitSprout; Revision: A; SheetNumber: 1; SheetTotal: 1; License: CC BY-SA 4.0; Version: 2.0; LibVersion: 2.7; PageSetup: Record=PageOptions|CenterHorizontal=True|CenterVertical=True|PrintScale=1.00|XCorrection=1.00|YCorrection=1.00|PrintKind=0|BorderSize=5000000|LeftOffset=0|BottomOffset=0|Orientation=2|PaperLength=1000|PaperWidth=1000|Scale=100|PaperSource=7|PrintQuality=-4|MediaType=1|DitherType=10|PaperKind=A4|PrintScaleMode=0
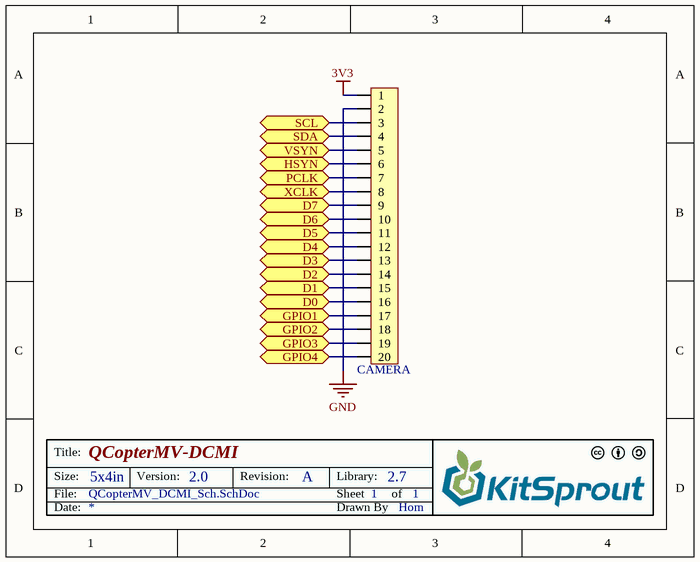
[diagram p7: QCopterMV_DCMI_Sch.SchDoc]

### Parts
CAMERA  HDR1x20_1.27  [HDR1X20_1.27_180F]  (value not drawn)

### Ports
D0, D1, D2, D3, D4, D5, D6, D7, GPIO1, GPIO2, GPIO3, GPIO4, HSYN, PCLK, SCL, SDA, VSYN, XCLK

### Nets
3V3: CAMERA.1
GND: CAMERA.2
CAM_D0: CAMERA.16 ; port D0
CAM_D1: CAMERA.15 ; port D1
CAM_D2: CAMERA.14 ; port D2
CAM_D3: CAMERA.13 ; port D3
CAM_D4: CAMERA.12 ; port D4
CAM_D5: CAMERA.11 ; port D5
CAM_D6: CAMERA.10 ; port D6
CAM_D7: CAMERA.9 ; port D7
CAM_HSYN: CAMERA.6 ; port HSYN
CAM_IO1: CAMERA.17 ; port GPIO1
CAM_IO3: CAMERA.19 ; port GPIO3
CAM_IO4: CAMERA.20 ; port GPIO4
CAM_PCLK: CAMERA.7 ; port PCLK
CAM_SCL: CAMERA.3 ; port SCL
CAM_SDA: CAMERA.4 ; port SDA
CAM_VSYN: CAMERA.5 ; port VSYN
CAM_XCLK: CAMERA.8 ; port XCLK
NetCAMERA_18: CAMERA.18 ; port GPIO2

### Notes on the sheet
- Title:
- Size:
- Date:
- File:
- 5x4in
- Version:
- Revision:
- Sheet
- Drawn By
- Library:
- of

### Library data of the parts
CAMERA = HDR1x20_1.27: Header

## Sheet QCopterMV_EXP_Sch.SchDoc: QCopterMV-EXPAND
size 127 x 101 mm; Author: Hom; CompanyName: KitSprout; DrawnBy: Hom; Engineer: Hom; Organization: KitSprout; Revision: A; SheetNumber: 1; SheetTotal: 1; License: CC BY-SA 4.0; Version: 2.0; LibVersion: 2.7; PageSetup: Record=PageOptions|CenterHorizontal=True|CenterVertical=True|PrintScale=1.00|XCorrection=1.00|YCorrection=1.00|PrintKind=0|BorderSize=5000000|LeftOffset=0|BottomOffset=0|Orientation=2|PaperLength=1000|PaperWidth=1000|Scale=100|PaperSource=7|PrintQuality=-4|MediaType=1|DitherType=10|PaperKind=A4|PrintScaleMode=0
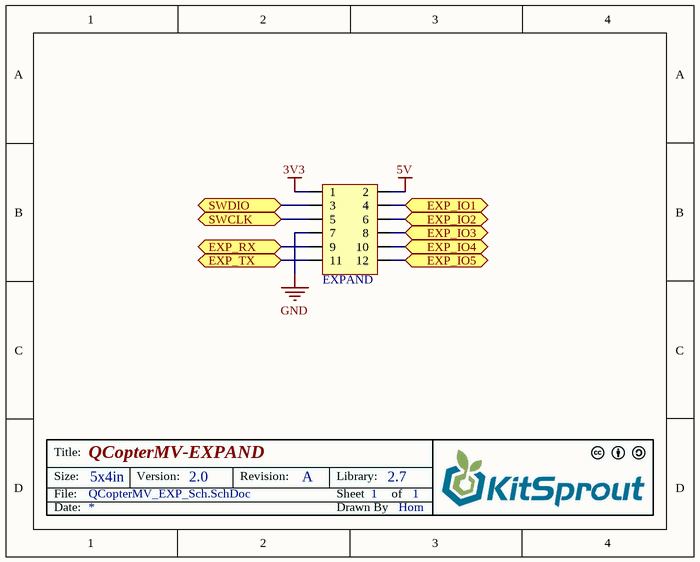
[diagram p8: QCopterMV_EXP_Sch.SchDoc]

### Parts
EXPAND  HDR2x6_1.27  [HDR2X6_1.27_180HF]  (value not drawn)

### Ports
EXP_IO1, EXP_IO2, EXP_IO3, EXP_IO4, EXP_IO5, EXP_RX, EXP_TX, SWCLK, SWDIO

### Nets
3V3: EXPAND.1
5V: EXPAND.2  [project net USB_VBUS]
GND: EXPAND.7
EXP_IO1: EXPAND.4 ; port EXP_IO1
EXP_IO2: EXPAND.6 ; port EXP_IO2
EXP_IO3: EXPAND.8 ; port EXP_IO3
EXP_IO4: EXPAND.10 ; port EXP_IO4
EXP_IO5: EXPAND.12 ; port EXP_IO5
EXP_RX: EXPAND.9 ; port EXP_RX
EXP_TX: EXPAND.11 ; port EXP_TX
SWCLK: EXPAND.5 ; port SWCLK
SWDIO: EXPAND.3 ; port SWDIO

### Notes on the sheet
- Title:
- Size:
- Date:
- File:
- 5x4in
- Version:
- Revision:
- Sheet
- Drawn By
- Library:
- of

### Library data of the parts
EXPAND = HDR2x6_1.27: Header

## Sheet QCopterMV_USB_Sch.SchDoc: QCopterMV-USB
size 127 x 101 mm; Author: Hom; CompanyName: KitSprout; DrawnBy: Hom; Engineer: Hom; Organization: KitSprout; Revision: A; SheetNumber: 1; SheetTotal: 1; License: CC BY-SA 4.0; Version: 2.0; LibVersion: 2.7; PageSetup: Record=PageOptions|CenterHorizontal=True|CenterVertical=True|PrintScale=1.00|XCorrection=1.00|YCorrection=1.00|PrintKind=0|BorderSize=5000000|LeftOffset=0|BottomOffset=0|Orientation=2|PaperLength=1000|PaperWidth=1000|Scale=100|PaperSource=7|PrintQuality=-4|MediaType=1|DitherType=10|PaperKind=A4|PrintScaleMode=0
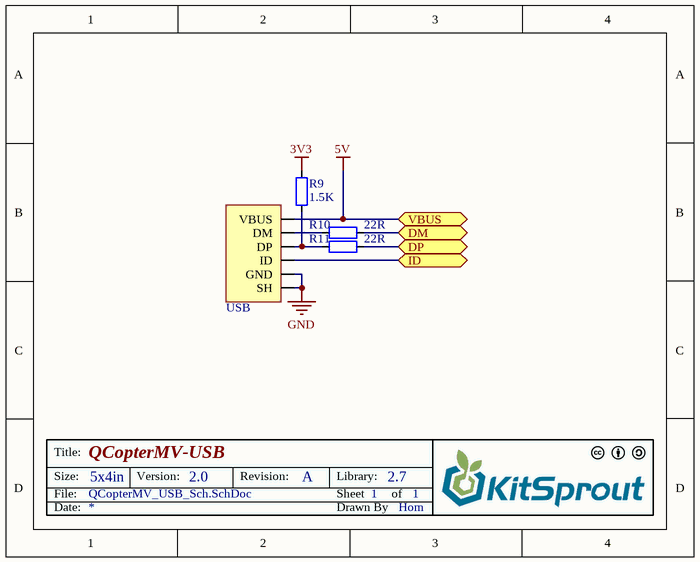
[diagram p9: QCopterMV_USB_Sch.SchDoc]

### Parts
R9  value 1.5K  [RES_0402]  (hidden comment: Res_0402)
R10  value 22R  [RES_0402]  (hidden comment: Res_0402)
R11  value 22R  [RES_0402]  (hidden comment: Res_0402)
USB  USB_Micro  [USB_Micro-AB]  (value not drawn)

### Ports
DM, DP, ID, VBUS

### Nets
3V3: R9.2
5V: USB.1(VBUS) ; port VBUS  [project net USB_VBUS]
GND: USB.0(SH) USB.5(GND)
USB_DM: R10.1 ; port DM
USB_DP: R11.1 ; port DP
USB_ID: USB.4(ID) ; port ID
NetR9_1: R9.1 R11.2 USB.3(DP)
NetR10_2: R10.2 USB.2(DM)

### Notes on the sheet
- Title:
- Size:
- Date:
- File:
- 5x4in
- Version:
- Revision:
- Sheet
- Drawn By
- Library:
- of

### Library data of the parts
R9-R11 = Res_0402: Resistor
USB = USB_Micro: USB

## Sheet QCopterMV_IMU_Sch.SchDoc: QCopterMV-IMU
size 127 x 101 mm; Author: Hom; CompanyName: KitSprout; DrawnBy: Hom; Engineer: Hom; Organization: KitSprout; Revision: A; SheetNumber: 1; SheetTotal: 1; License: CC BY-SA 4.0; Version: 2.0; LibVersion: 2.7; PageSetup: Record=PageOptions|CenterHorizontal=True|CenterVertical=True|PrintScale=1.00|XCorrection=1.00|YCorrection=1.00|PrintKind=0|BorderSize=5000000|LeftOffset=0|BottomOffset=0|Orientation=2|PaperLength=1000|PaperWidth=1000|Scale=100|PaperSource=7|PrintQuality=-4|MediaType=1|DitherType=10|PaperKind=A4|PrintScaleMode=0
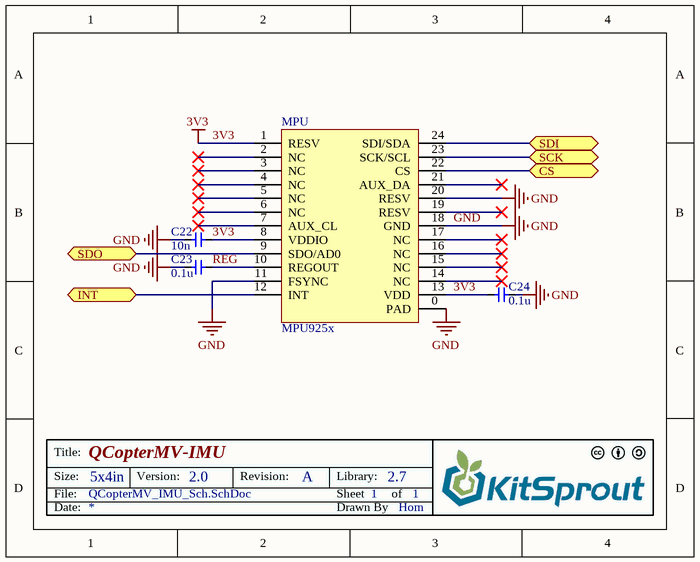
[diagram p10: QCopterMV_IMU_Sch.SchDoc]

### Parts
C22  value 10n  [CAP_0402]  (hidden comment: Cap_0402)
C23  value 0.1u  [CAP_0402]  (hidden comment: Cap_0402)
C24  value 0.1u  [CAP_0402]  (hidden comment: Cap_0402)
MPU  MPU925x  [QFN_P0.4_24]

### Ports
CS, INT, SCK, SDI, SDO

### Nets
3V3: C22.2 C24.1 MPU.1(RESV) MPU.8(VDDIO) MPU.13(VDD)
GND: C22.1 C23.1 C24.2 MPU.0(PAD) MPU.11(FSYNC) MPU.18(GND) MPU.20(RESV)
IMU_CS: MPU.22(CS) ; port CS
IMU_SCK: MPU.23(SCK/SCL) ; port SCK
IMU_SDI: MPU.24(SDI/SDA) ; port SDI
IMU_SDO: MPU.9(SDO/AD0) ; port SDO
REG: C23.2 MPU.10(REGOUT)
NetMPU_12: MPU.12(INT) ; port INT

Not connected (* = marked no-connect by the designer): MPU 2(NC)* 3(NC)* 4(NC)* 5(NC)* 6(NC)* 7(AUX_CL)* 14(NC)* 15(NC)* 16(NC)* 17(NC)* 19(RESV)* 21(AUX_DA)*

### Notes on the sheet
- Title:
- Size:
- Date:
- File:
- 5x4in
- Version:
- Revision:
- Sheet
- Drawn By
- Library:
- of

### Library data of the parts
C22-C24 = Cap_0402: Capacitor
MPU = MPU925x: Sensor Motion

## Nets that join several sheets
3V3: QCopterMV_MCU_Sch (30 pins), QCopterMV_FMC_Sch (15 pins), QCopterMV_PWR_Sch (C4.2 R1.2 RT.5), QCopterMV_LED_KEY_Sch (D2.2 KEY.3), QCopterMV_FFC_Sch (R17.1), QCopterMV_SD_Sch (7 pins), QCopterMV_DCMI_Sch (CAMERA.1), QCopterMV_EXP_Sch (EXPAND.1), QCopterMV_USB_Sch (R9.2), QCopterMV_IMU_Sch (5 pins)
GND: QCopterMV_MCU_Sch (28 pins), QCopterMV_FMC_Sch (15 pins), QCopterMV_PWR_Sch (6 pins), QCopterMV_LED_KEY_Sch (R8.1), QCopterMV_FFC_Sch (7 pins), QCopterMV_SD_Sch (C25.1 SD.6 SD.9), QCopterMV_DCMI_Sch (CAMERA.2), QCopterMV_EXP_Sch (EXPAND.7), QCopterMV_USB_Sch (USB.0 USB.5), QCopterMV_IMU_Sch (7 pins)
USB_VBUS: QCopterMV_MCU_Sch (STM32.101), QCopterMV_PWR_Sch (C1.2 C2.2 RT.1 RT.3), QCopterMV_EXP_Sch (EXPAND.2), QCopterMV_USB_Sch (USB.1)
CAM_D0: QCopterMV_MCU_Sch (STM32.96), QCopterMV_DCMI_Sch (CAMERA.16)
CAM_D1: QCopterMV_MCU_Sch (STM32.97), QCopterMV_DCMI_Sch (CAMERA.15)
CAM_D2: QCopterMV_MCU_Sch (STM32.125), QCopterMV_DCMI_Sch (CAMERA.14)
CAM_D3: QCopterMV_MCU_Sch (STM32.126), QCopterMV_DCMI_Sch (CAMERA.13)
CAM_D4: QCopterMV_MCU_Sch (STM32.3), QCopterMV_DCMI_Sch (CAMERA.12)
CAM_D5: QCopterMV_MCU_Sch (STM32.117), QCopterMV_DCMI_Sch (CAMERA.11)
CAM_D6: QCopterMV_MCU_Sch (STM32.4), QCopterMV_DCMI_Sch (CAMERA.10)
CAM_D7: QCopterMV_MCU_Sch (STM32.5), QCopterMV_DCMI_Sch (CAMERA.9)
CAM_HSYN: QCopterMV_MCU_Sch (STM32.40), QCopterMV_DCMI_Sch (CAMERA.6)
CAM_IO1: QCopterMV_MCU_Sch (STM32.8), QCopterMV_DCMI_Sch (CAMERA.17)
CAM_IO3: QCopterMV_MCU_Sch (STM32.1), QCopterMV_DCMI_Sch (CAMERA.19)
CAM_IO4: QCopterMV_MCU_Sch (STM32.2), QCopterMV_DCMI_Sch (CAMERA.20)
CAM_PCLK: QCopterMV_MCU_Sch (STM32.42), QCopterMV_DCMI_Sch (CAMERA.7)
CAM_SCL: QCopterMV_MCU_Sch (STM32.139), QCopterMV_DCMI_Sch (CAMERA.3)
CAM_SDA: QCopterMV_MCU_Sch (STM32.140), QCopterMV_DCMI_Sch (CAMERA.4)
CAM_VSYN: QCopterMV_MCU_Sch (STM32.137), QCopterMV_DCMI_Sch (CAMERA.5)
CAM_XCLK: QCopterMV_MCU_Sch (STM32.43), QCopterMV_DCMI_Sch (CAMERA.8)
EXP_IO1: QCopterMV_MCU_Sch (STM32.110), QCopterMV_EXP_Sch (EXPAND.4)
EXP_IO2: QCopterMV_MCU_Sch (STM32.127), QCopterMV_EXP_Sch (EXPAND.6)
EXP_IO3: QCopterMV_MCU_Sch (STM32.128), QCopterMV_EXP_Sch (EXPAND.8)
EXP_IO4: QCopterMV_MCU_Sch (STM32.133), QCopterMV_EXP_Sch (EXPAND.10)
EXP_IO5: QCopterMV_MCU_Sch (STM32.134), QCopterMV_EXP_Sch (EXPAND.12)
EXP_RX: QCopterMV_MCU_Sch (STM32.124), QCopterMV_EXP_Sch (EXPAND.9)
EXP_TX: QCopterMV_MCU_Sch (STM32.129), QCopterMV_EXP_Sch (EXPAND.11)
FFC_CS: QCopterMV_MCU_Sch (STM32.18), QCopterMV_FFC_Sch (FFCSPI.6)
FFC_IO1: QCopterMV_MCU_Sch (STM32.34), QCopterMV_FFC_Sch (FFCSPI.3)
FFC_IO2: QCopterMV_MCU_Sch (STM32.22), QCopterMV_FFC_Sch (FFCSPI.4)
FFC_IO3: QCopterMV_MCU_Sch (STM32.9), QCopterMV_FFC_Sch (FFCSPI.14)
FFC_IO4: QCopterMV_MCU_Sch (STM32.7), QCopterMV_FFC_Sch (FFCSPI.16)
FFC_SCK: QCopterMV_MCU_Sch (STM32.19), QCopterMV_FFC_Sch (FFCSPI.8)
FFC_SDI: QCopterMV_MCU_Sch (STM32.21), QCopterMV_FFC_Sch (FFCSPI.12)
FFC_SDO: QCopterMV_MCU_Sch (STM32.20), QCopterMV_FFC_Sch (FFCSPI.10)
IMU_CS: QCopterMV_MCU_Sch (STM32.73), QCopterMV_IMU_Sch (MPU.22)
IMU_SCK: QCopterMV_MCU_Sch (STM32.74), QCopterMV_IMU_Sch (MPU.23)
IMU_SDI: QCopterMV_MCU_Sch (STM32.76), QCopterMV_IMU_Sch (MPU.24)
IMU_SDO: QCopterMV_MCU_Sch (STM32.75), QCopterMV_IMU_Sch (MPU.9)
KEY: QCopterMV_MCU_Sch (STM32.48), QCopterMV_LED_KEY_Sch (KEY.4 R8.2)
LCD_CS: QCopterMV_MCU_Sch (STM32.123), QCopterMV_FMC_Sch (FMC.20)
LCD_D0: QCopterMV_MCU_Sch (STM32.85), QCopterMV_FMC_Sch (FMC.18 ISSI.2)
LCD_D1: QCopterMV_MCU_Sch (STM32.86), QCopterMV_FMC_Sch (FMC.17 ISSI.4)
LCD_D2: QCopterMV_MCU_Sch (STM32.114), QCopterMV_FMC_Sch (FMC.16 ISSI.5)
LCD_D3: QCopterMV_MCU_Sch (STM32.115), QCopterMV_FMC_Sch (FMC.15 ISSI.7)
LCD_D4: QCopterMV_MCU_Sch (STM32.58), QCopterMV_FMC_Sch (FMC.14 ISSI.8)
LCD_D5: QCopterMV_MCU_Sch (STM32.59), QCopterMV_FMC_Sch (FMC.13 ISSI.10)
LCD_D6: QCopterMV_MCU_Sch (STM32.60), QCopterMV_FMC_Sch (FMC.12 ISSI.11)
LCD_D7: QCopterMV_MCU_Sch (STM32.63), QCopterMV_FMC_Sch (FMC.11 ISSI.13)
LCD_D8: QCopterMV_MCU_Sch (STM32.64), QCopterMV_FMC_Sch (FMC.10 ISSI.42)
LCD_D9: QCopterMV_MCU_Sch (STM32.65), QCopterMV_FMC_Sch (FMC.9 ISSI.44)
LCD_D10: QCopterMV_MCU_Sch (STM32.66), QCopterMV_FMC_Sch (FMC.8 ISSI.45)
LCD_D11: QCopterMV_MCU_Sch (STM32.67), QCopterMV_FMC_Sch (FMC.7 ISSI.47)
LCD_D12: QCopterMV_MCU_Sch (STM32.68), QCopterMV_FMC_Sch (FMC.6 ISSI.48)
LCD_D13: QCopterMV_MCU_Sch (STM32.77), QCopterMV_FMC_Sch (FMC.5 ISSI.50)
LCD_D14: QCopterMV_MCU_Sch (STM32.78), QCopterMV_FMC_Sch (FMC.4 ISSI.51)
LCD_D15: QCopterMV_MCU_Sch (STM32.79), QCopterMV_FMC_Sch (FMC.3 ISSI.53)
LCD_LIG: QCopterMV_MCU_Sch (STM32.100), QCopterMV_FMC_Sch (FMC.2)
LCD_RD: QCopterMV_MCU_Sch (STM32.118), QCopterMV_FMC_Sch (FMC.22)
LCD_RS: QCopterMV_MCU_Sch (STM32.80), QCopterMV_FMC_Sch (FMC.19)
LCD_RST: QCopterMV_MCU_Sch (STM32.92), QCopterMV_FMC_Sch (FMC.1)
LCD_WR: QCopterMV_MCU_Sch (STM32.119), QCopterMV_FMC_Sch (FMC.21)
LED_B: QCopterMV_MCU_Sch (STM32.37), QCopterMV_LED_KEY_Sch (R5.2)
LED_G: QCopterMV_MCU_Sch (STM32.36), QCopterMV_LED_KEY_Sch (R6.2)
LED_R: QCopterMV_MCU_Sch (STM32.35), QCopterMV_LED_KEY_Sch (R7.2)
SD_CK: QCopterMV_MCU_Sch (STM32.113), QCopterMV_SD_Sch (SD.5)
SD_CMD: QCopterMV_MCU_Sch (STM32.116), QCopterMV_SD_Sch (R14.2 SD.3)
SD_D0: QCopterMV_MCU_Sch (STM32.98), QCopterMV_SD_Sch (R15.2 SD.7)
SD_D1: QCopterMV_MCU_Sch (STM32.99), QCopterMV_SD_Sch (R16.2 SD.8)
SD_D2: QCopterMV_MCU_Sch (STM32.111), QCopterMV_SD_Sch (R12.2 SD.1)
SD_D3: QCopterMV_MCU_Sch (STM32.112), QCopterMV_SD_Sch (R13.2 SD.2)
SDR_A0: QCopterMV_MCU_Sch (STM32.10), QCopterMV_FMC_Sch (ISSI.23)
SDR_A1: QCopterMV_MCU_Sch (STM32.11), QCopterMV_FMC_Sch (ISSI.24)
SDR_A2: QCopterMV_MCU_Sch (STM32.12), QCopterMV_FMC_Sch (ISSI.25)
SDR_A3: QCopterMV_MCU_Sch (STM32.13), QCopterMV_FMC_Sch (ISSI.26)
SDR_A4: QCopterMV_MCU_Sch (STM32.14), QCopterMV_FMC_Sch (ISSI.29)
SDR_A5: QCopterMV_MCU_Sch (STM32.15), QCopterMV_FMC_Sch (ISSI.30)
SDR_A6: QCopterMV_MCU_Sch (STM32.50), QCopterMV_FMC_Sch (ISSI.31)
SDR_A7: QCopterMV_MCU_Sch (STM32.53), QCopterMV_FMC_Sch (ISSI.32)
SDR_A8: QCopterMV_MCU_Sch (STM32.54), QCopterMV_FMC_Sch (ISSI.33)
SDR_A9: QCopterMV_MCU_Sch (STM32.55), QCopterMV_FMC_Sch (ISSI.34)
SDR_A10: QCopterMV_MCU_Sch (STM32.56), QCopterMV_FMC_Sch (ISSI.22)
SDR_A11: QCopterMV_MCU_Sch (STM32.57), QCopterMV_FMC_Sch (ISSI.35)
SDR_BA0: QCopterMV_MCU_Sch (STM32.89), QCopterMV_FMC_Sch (ISSI.20)
SDR_BA1: QCopterMV_MCU_Sch (STM32.90), QCopterMV_FMC_Sch (ISSI.21)
SDR_CAS: QCopterMV_MCU_Sch (STM32.132), QCopterMV_FMC_Sch (ISSI.17)
SDR_CKE1: QCopterMV_MCU_Sch (STM32.135), QCopterMV_FMC_Sch (ISSI.37)
SDR_CLK: QCopterMV_MCU_Sch (STM32.93), QCopterMV_FMC_Sch (ISSI.38)
SDR_NBL0: QCopterMV_MCU_Sch (STM32.141), QCopterMV_FMC_Sch (ISSI.15)
SDR_NBL1: QCopterMV_MCU_Sch (STM32.142), QCopterMV_FMC_Sch (ISSI.39)
SDR_NE1: QCopterMV_MCU_Sch (STM32.136), QCopterMV_FMC_Sch (ISSI.19)
SDR_RAS: QCopterMV_MCU_Sch (STM32.49), QCopterMV_FMC_Sch (ISSI.18)
SDR_WE: QCopterMV_MCU_Sch (STM32.26), QCopterMV_FMC_Sch (ISSI.16)
SWCLK: QCopterMV_MCU_Sch (STM32.109), QCopterMV_EXP_Sch (EXPAND.5)
SWDIO: QCopterMV_MCU_Sch (STM32.105), QCopterMV_EXP_Sch (EXPAND.3)
USB_DM: QCopterMV_MCU_Sch (STM32.103), QCopterMV_USB_Sch (R10.1)
USB_DP: QCopterMV_MCU_Sch (STM32.104), QCopterMV_USB_Sch (R11.1)
USB_ID: QCopterMV_MCU_Sch (STM32.102), QCopterMV_USB_Sch (USB.4)